# Altium schematic sheet High_Level_Diagram.SchDoc
size A4; SheetNumber: 1; SheetTotal: 11
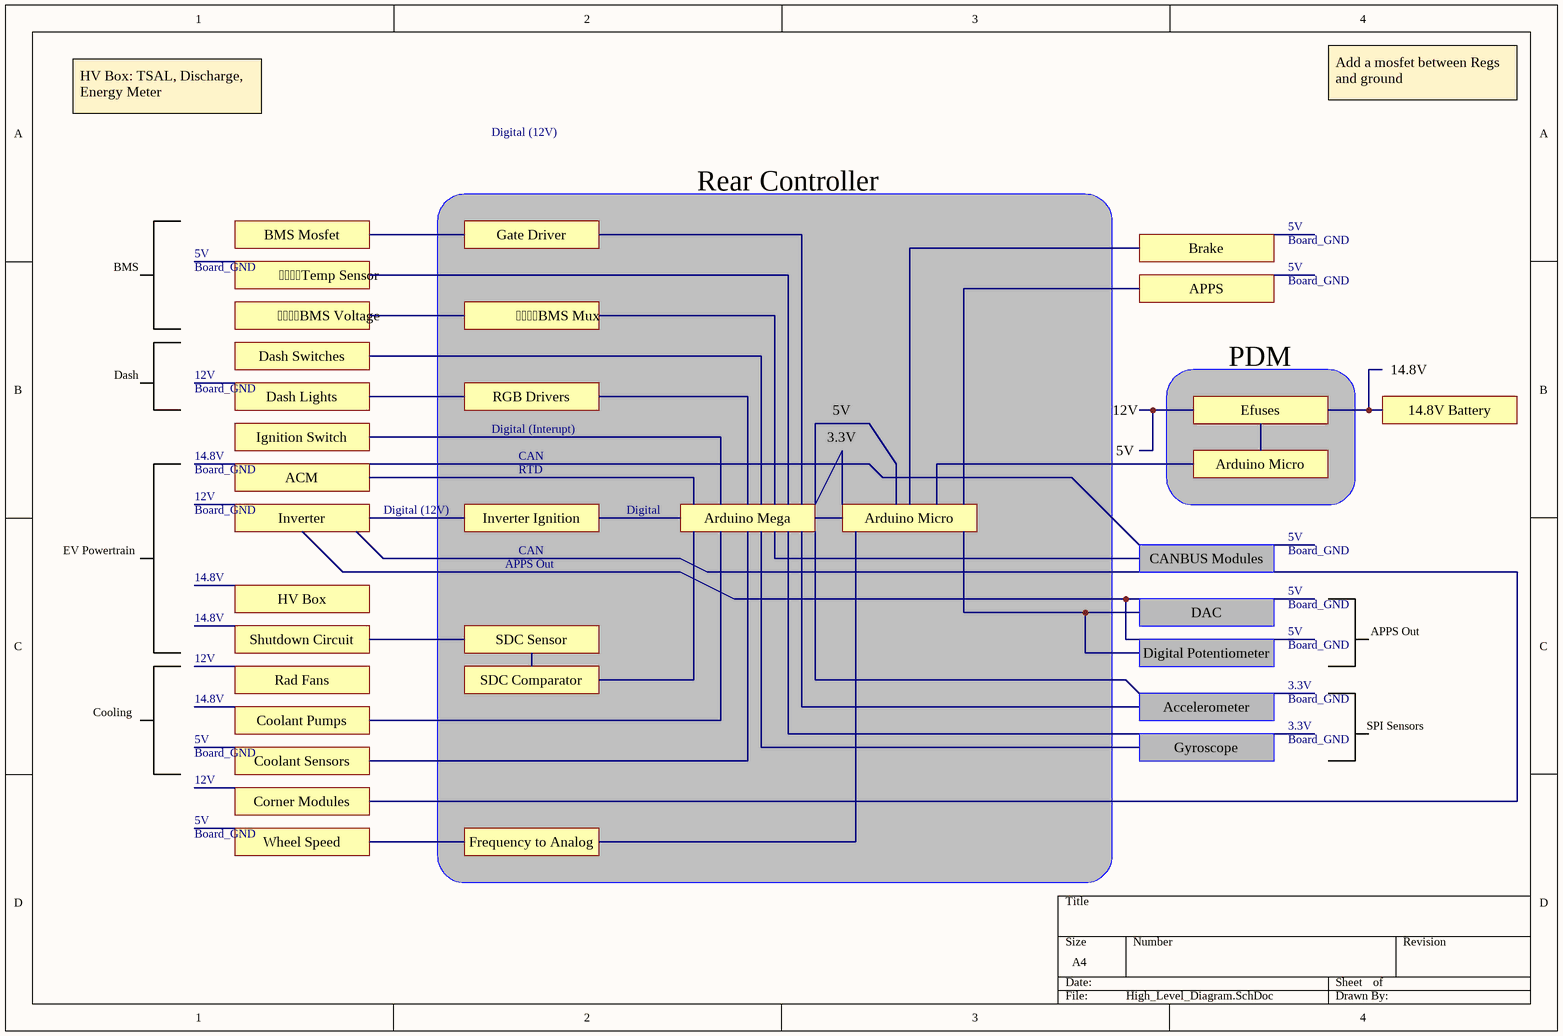
[diagram p0: High_Level_Diagram.SchDoc]

## Notes on the sheet
- HV Box: TSAL, Discharge, Energy Meter
- Add a mosfet between Regs and ground
- Digital (12V)
- Rear Controller
- BMS Mosfet
- Gate Driver
- Brake
- 5V
- Board_GND
- BMS
- BMS Voltage
- Temp Sensor
- BMS Mux
- APPS
- Dash
- 12V
- Dash Switches
- PDM
- 14.8V
- Ignition Switch
- Dash Lights
- Digital (Interupt)
- RGB Drivers
- 3.3V
- Efuses
- 14.8V Battery
- Inverter
- ACM
- RTD
- CAN
- Inverter Ignition
- Digital
- Arduino Mega
- Arduino Micro
- EV Powertrain
- APPS Out
- CANBUS Modules
- Shutdown Circuit
- HV Box
- SDC Sensor
- Digital Potentiometer
- DAC
- Cooling
- Coolant Pumps
- Rad Fans
- SDC Comparator
- Accelerometer
- Coolant Sensors
- Gyroscope
- SPI Sensors
- Corner Modules
- Wheel Speed
- Frequency to Analog